# Altium schematic sheet 电磁检测.SchDoc
size A4
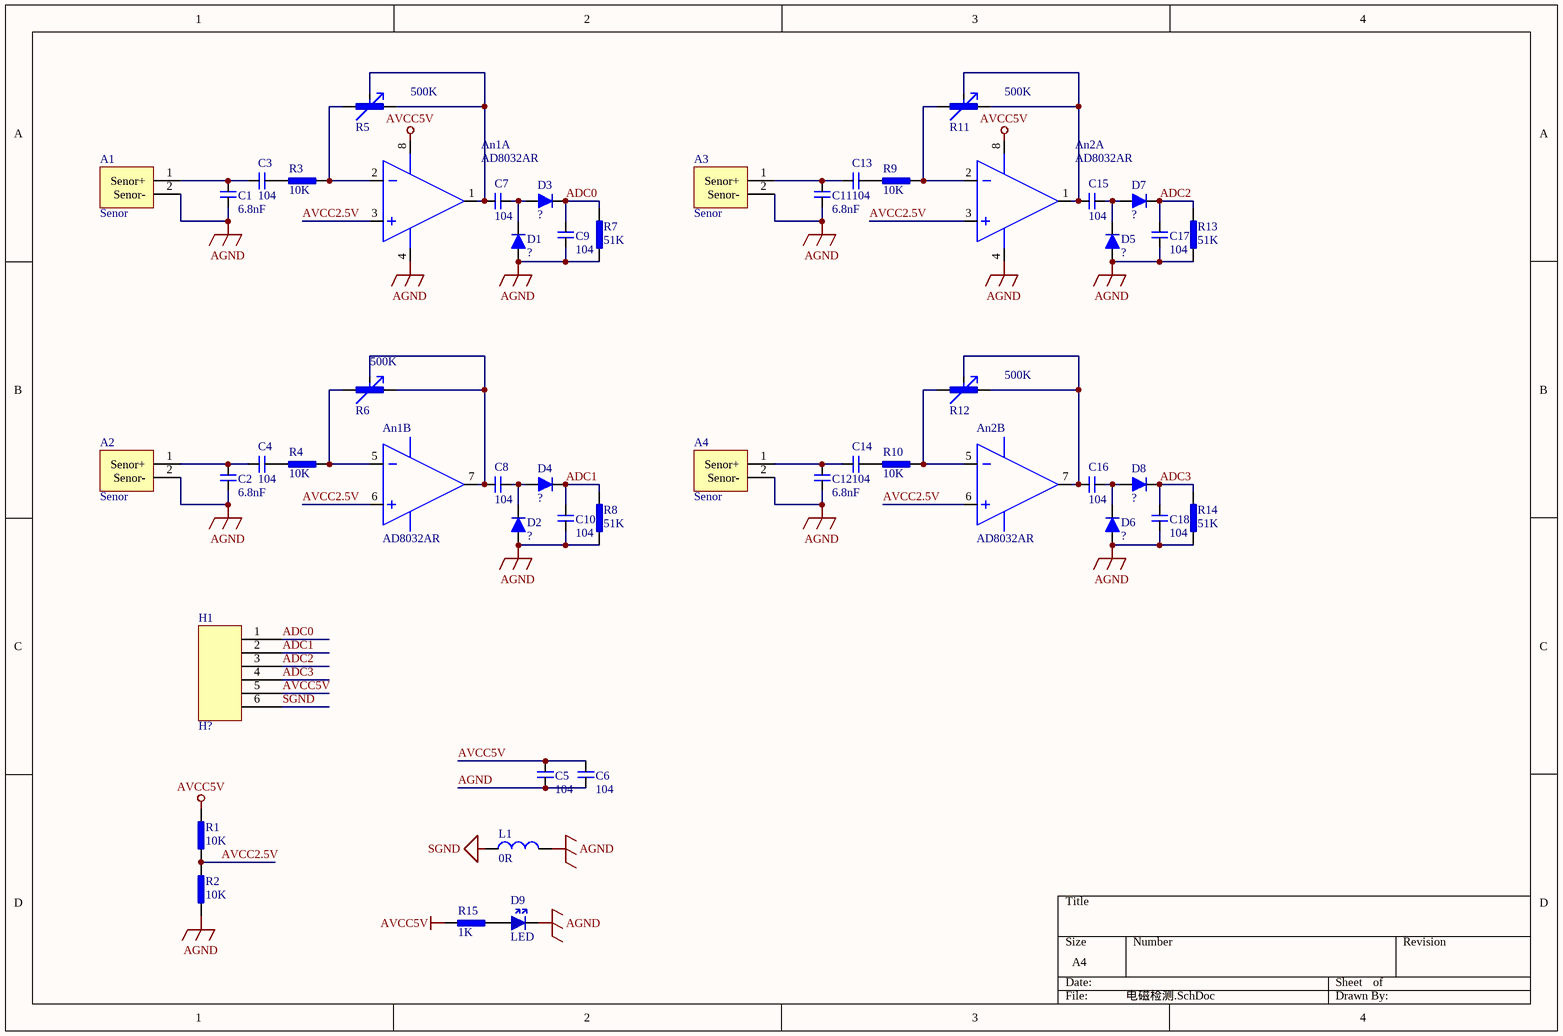
[diagram p0: 电磁检测.SchDoc]

## Parts
A1  Senor  [Senor]
A2  Senor  [Senor]
A3  Senor  [Senor]
A4  Senor  [Senor]
An1  AD8032AR  [MSOP8]  (parts A,B of 2)
An2  AD8032AR  [MSOP8]  (parts A,B of 2)
C1  6.8nF  [CAP 6.8nf]
C2  6.8nF  [cap 6.8nf]
C3  104  [C 0805]
C4  104  [C 0805]
C5  104  [C 0805]
C6  104  [C 0805]
C7  104  [C 0805]
C8  104  [C 0805]
C9  104  [C 0805]
C10  104  [C 0805]
C11  6.8nF  [CAP 6.8nf]
C12  6.8nF  [CAP 6.8nf]
C13  104  [C 0805]
C14  104  [C 0805]
C15  104  [C 0805]
C16  104  [C 0805]
C17  104  [C 0805]
C18  104  [C 0805]
D1  ?  [SOD323]
D2  ?  [SOD323]
D3  ?  [SOD323]
D4  ?  [SOD323]
D5  ?  [SOD323]
D6  ?  [SOD323]
D7  ?  [SOD323]
D8  ?  [SOD323]
D9  LED  [0805LED]
H1  H?  [HDR1X6]
L1  0R  [L0805]
R1  10K  [R 0805]
R2  10K  [R 0805]
R3  10K  [R0805]
R4  10K  [R0805]
R5  500K  [精密滑变]
R6  500K  [精密滑变]
R7  51K  [R0805]
R8  51K  [R0805]
R9  10K  [R0805]
R10  10K  [R0805]
R11  500K  [精密滑变]
R12  500K  [精密滑变]
R13  51K  [R0805]
R14  51K  [R0805]
R15  1K  [R 0805]

## Nets
AGND: A1.2(Senor-) A2.2(Senor-) A3.2(Senor-) A4.2(Senor-) An1.4 An2.4 C1.1 C2.1 C5.1 C6.1 C9.1 C10.1 C11.1 C12.1 C17.1 C18.1 D1.2 D2.2 D5.2 D6.2 D9.2 L1.1 R2.1 R7.1 R8.1 R13.1 R14.1
AVCC5V: An1.8 An2.8 C5.2 C6.2 H1.5 R1.2 R15.1
SGND: H1.6 L1.2
ADC0: C9.2 D3.1 H1.1 R7.2
ADC1: C10.2 D4.1 H1.2 R8.2
ADC2: C17.2 D7.1 H1.3 R13.2
ADC3: C18.2 D8.1 H1.4 R14.2
AVCC2.5V: An1.3 An1.6 An2.3 An2.6 R1.1 R2.2
NetA1_1: A1.1(Senor+) C1.2 C3.2
NetA2_1: A2.1(Senor+) C2.2 C4.2
NetA3_1: A3.1(Senor+) C11.2 C13.2
NetA4_1: A4.1(Senor+) C12.2 C14.2
NetAn1_1: An1.1 C7.1 R5.2 R5.?1
NetAn1_2: An1.2 R3.2 R5.1
NetAn1_5: An1.5 R4.2 R6.1
NetAn1_7: An1.7 C8.1 R6.2 R6.?1
NetAn2_1: An2.1 C15.1 R11.2 R11.?1
NetAn2_2: An2.2 R9.2 R11.1
NetAn2_5: An2.5 R10.2 R12.1
NetAn2_7: An2.7 C16.1 R12.2 R12.?1
NetC3_1: C3.1 R3.1
NetC4_1: C4.1 R4.1
NetC7_2: C7.2 D1.1 D3.2
NetC8_2: C8.2 D2.1 D4.2
NetC13_1: C13.1 R9.1
NetC14_1: C14.1 R10.1
NetC15_2: C15.2 D5.1 D7.2
NetC16_2: C16.2 D6.1 D8.2
NetD9_1: D9.1 R15.2

## Notes on the sheet
- (in symbol AD8032AR, part A) A
- (in symbol AD8032AR, part B) A

## Library data of the parts
C1-C18 = CAP
D1-D8 = Diode
H1 = header6
L1 = Inductance
R1-R4 R7-R10 R13-R15 = RES
R5 R6 R11 R12 = RES_ADJ